# EAGLE schematic TINRS-Snek (EAGLE 7.7.0)
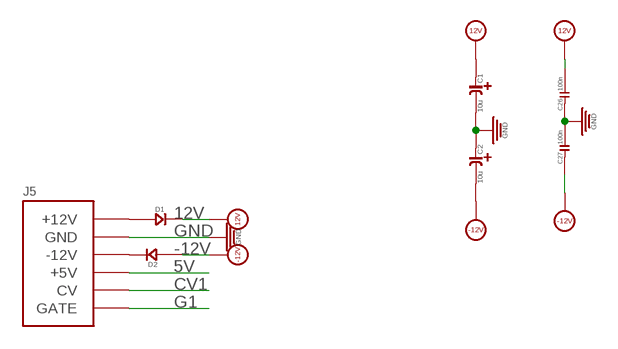
[diagram p0: schematic, sheet 1, part 1 of 2]
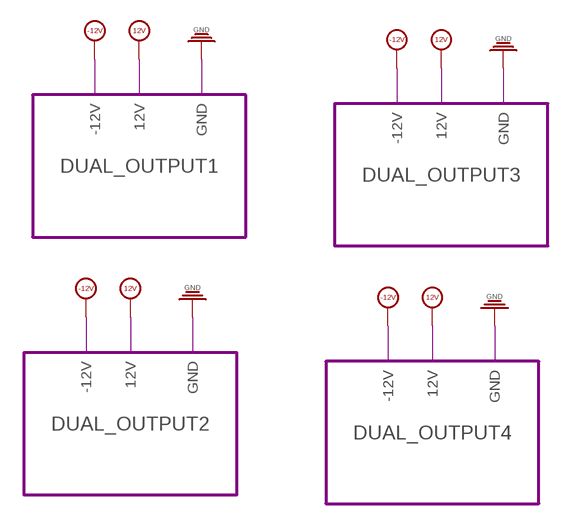
[diagram p1: schematic, sheet 1, part 2 of 2]

## Parts
C1  10u  C-POLAR-A  [CASE-A_3216]
C2  10u  C-POLAR-A  [CASE-A_3216]
C26  100n  C-0603  [C0603]
C27  100n  C-0603  [C0603]
D1  D-SMA  [DO-214AC]
D2  D-SMA  [DO-214AC]
J5  POWERSHROUDED  [POWER_16_SHROUDED]

## Module instances
DUAL_OUTPUT1 = DUAL_OUTPUT
DUAL_OUTPUT2 = DUAL_OUTPUT
DUAL_OUTPUT3 = DUAL_OUTPUT
DUAL_OUTPUT4 = DUAL_OUTPUT

## Nets
5V [power]: J5.11(+5V) J5.12(+5V)
12V [power]: C1.+ C26.2 D1.2(-) ; port DUAL_OUTPUT1.12V DUAL_OUTPUT2.12V DUAL_OUTPUT3.12V DUAL_OUTPUT4.12V
-12V [power]: C2.- C27.1 D2.1(+) ; port DUAL_OUTPUT1.-12V DUAL_OUTPUT2.-12V DUAL_OUTPUT3.-12V DUAL_OUTPUT4.-12V
CV1: J5.13(CV) J5.14(CV)
G1: J5.15(GATE) J5.16(GATE)
GND: C1.- C2.+ C26.1 J5.3(GND) J5.4(GND) J5.5(GND) J5.6(GND) J5.7(GND) J5.8(GND) ; port DUAL_OUTPUT1.GND DUAL_OUTPUT2.GND DUAL_OUTPUT3.GND DUAL_OUTPUT4.GND
GND1: C27.2
N$1 [power]: D1.1(+) J5.9(+12V) J5.10(+12V)
N$2 [power]: D2.2(-) J5.1(-12V) J5.2(-12V)

## Library data of the parts
C1 C2 = EurorackModularParts:C-POLAR*
C26 C27 = OPL:C*
D1 D2 = OPL:D*: DIODE
J5 = EurorackModularParts:POWER

## Module DUAL_OUTPUT
Ports: -12V(io) 12V(io) GND(io)
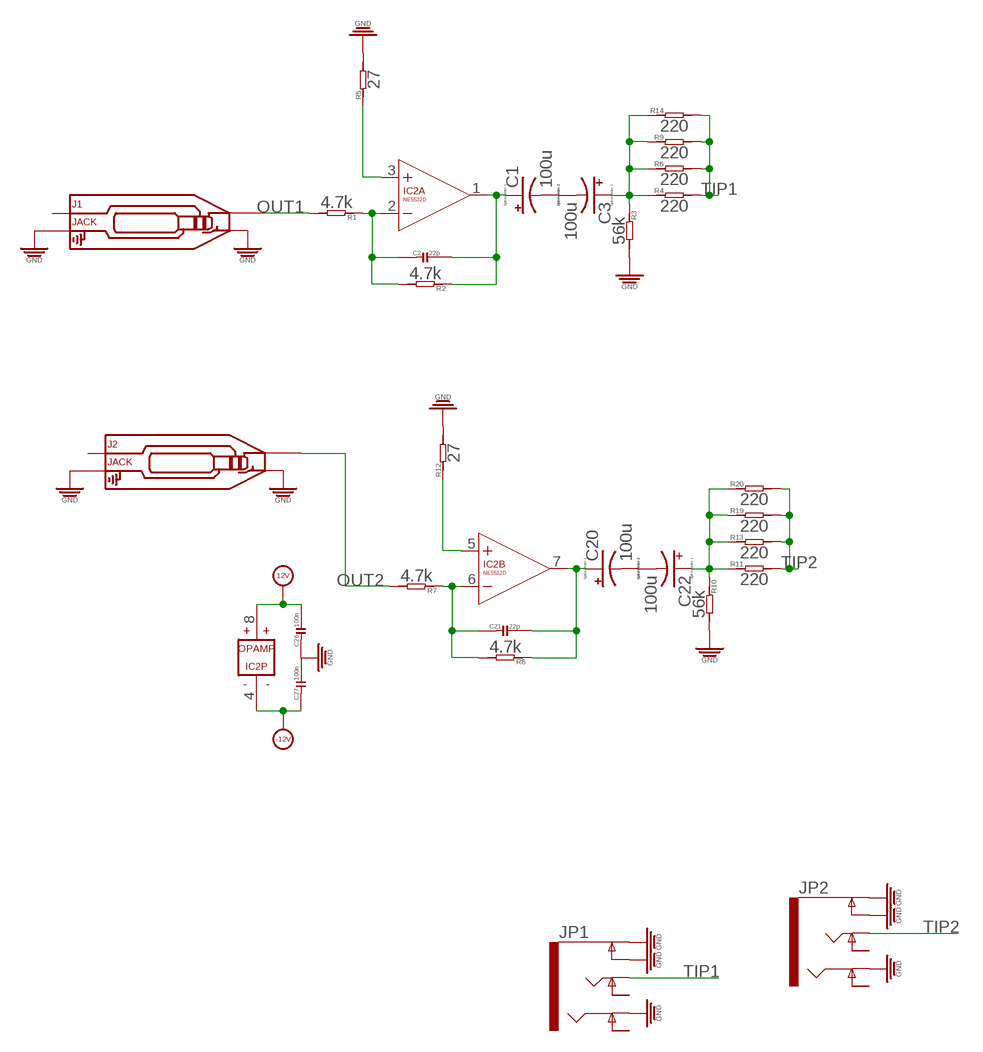
[diagram p2: schematic, module DUAL_OUTPUT, sheet 1]

### Parts
C1  100u  CPOL-USD  [PANASONIC_D]
C2  22p  C-0603  [C0603]
C3  100u  CPOL-USD  [PANASONIC_D]
C20  100u  CPOL-USD  [PANASONIC_D]
C21  22p  C-0603  [C0603]
C22  100u  CPOL-USD  [PANASONIC_D]
C26  100n  C-0603  [C0603]
C27  100n  C-0603  [C0603]
IC2  NE5532D  [SO08]
J1  JACK  AUDIO-JACK_SMALLSYMBOLNODRILL  [3.5MM-JACK-SWITCH-13MM-NOHOLES]
J2  JACK  AUDIO-JACK_SMALLSYMBOLNODRILL  [3.5MM-JACK-SWITCH-13MM-NOHOLES]
JP1  AUDIO-JACK4-.25-HORIZ-TRS  [AUDIO-JACK-.25-INCH-HORIZ-PTH]
JP2  AUDIO-JACK4-.25-HORIZ-TRS  [AUDIO-JACK-.25-INCH-HORIZ-PTH]
R1  4.7k  R-0603  [R0603]
R2  4.7k  R-0603  [R0603]
R3  56k  R-0603  [R0603]
R4  220  R-0603  [R0603]
R5  27  R-0603  [R0603]
R6  220  R-0603  [R0603]
R7  4.7k  R-0603  [R0603]
R8  4.7k  R-0603  [R0603]
R9  220  R-0603  [R0603]
R10  56k  R-0603  [R0603]
R11  220  R-0603  [R0603]
R12  27  R-0603  [R0603]
R13  220  R-0603  [R0603]
R14  220  R-0603  [R0603]
R19  220  R-0603  [R0603]
R20  220  R-0603  [R0603]

### Nets
12V [power]: C26.2 IC2.8(P:V+)
-12V [power]: C27.1 IC2.4(P:V-)
GND: C26.1 C27.2 J1.RING_B@1(RING) J1.RING_T@3(RING) J1.SWITCH_B@1(SWITCH) J1.SWITCH_T@3(SWITCH) J2.RING_B@1(RING) J2.RING_T@3(RING) J2.SWITCH_B@1(SWITCH) J2.SWITCH_T@3(SWITCH) JP1.P$2(EARTH) JP1.P$3(EARTH-NORM) JP1.P$4(RING) JP2.P$2(EARTH) JP2.P$3(EARTH-NORM) JP2.P$4(RING) R3.2 R5.2 R10.2 R12.2
N$1: C21.1 IC2.6(B:-IN) R7.1 R8.2
N$2: C20.+ C21.2 IC2.7(B:OUT) R8.1
N$3: C22.+ R10.1 R11.1 R13.1 R19.1 R20.1
N$4: IC2.5(B:+IN) R12.1
N$5: C2.1 IC2.2(A:-IN) R1.1 R2.2
N$6: C1.+ C2.2 IC2.1(A:OUT) R2.1
N$7: C3.+ R3.1 R4.1 R6.1 R9.1 R14.1
N$8: IC2.3(A:+IN) R5.1
N$11: C20.- C22.-
N$12: C1.- C3.-
OUT1: J1.TIP_B@1(TIP) J1.TIP_T@3(TIP) R1.2
OUT2: J2.TIP_B@1(TIP) J2.TIP_T@3(TIP) R7.2
TIP1: JP1.P$6(TIP) R4.2 R6.2 R9.2 R14.2
TIP2: JP2.P$6(TIP) R11.2 R13.2 R19.2 R20.2
Unconnected: J1.SECOND_B@1(SECOND) J1.SECOND_T@3(SECOND) J2.SECOND_B@1(SECOND) J2.SECOND_T@3(SECOND) JP1.P$5(RING-NORM) JP1.P$7(TIP-NORM) JP2.P$5(RING-NORM) JP2.P$7(TIP-NORM)

### Library data of the parts
C1 C3 C20 C22 = resistor:CPOL-US: POLARIZED CAPACITOR, American symbol
C2 C21 C26 C27 = OPL:C*
IC2 = EurorackModularParts:NE5532: AUDIO AMPLIFIER
J1 J2 = EurorackModularParts:AUDIO-JACK_SMALLSYMBOL: Switching Mono 3.5mm Audio Jack from Erthenvar.
JP1 JP2 = EurorackModularParts:AUDIO-JACK4-.25-HORIZ-TRS: 1/4" TRS jack, horizontal Production SKU: COM-11144 Footprint unproven - datasheet and part seem to be slightly different; PROD_ID: COM-11144
R1-R14 R19 R20 = OPL:R*

## Net classes
0 default: width 0.254 mm
1 power: width 1 mm